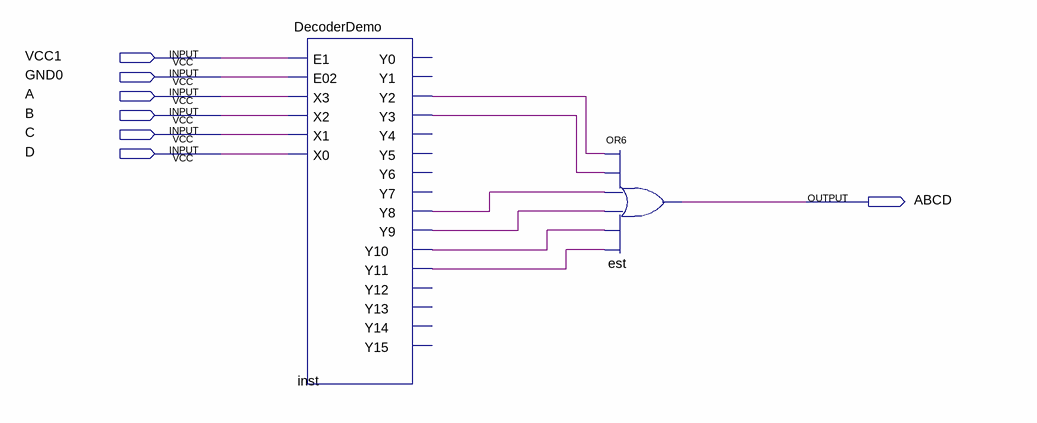
[diagram p0: schematic sheet]
// Quartus schematic DecoderDemo3.bdf as structural Verilog: 2 symbols, 7 pins
module DecoderDemo3 (
  input  VCC1,
  input  GND0,
  input  A,
  input  B,
  input  C,
  input  D,
  output ABCD
);

  wire inst_y2, inst_y3, inst_y8, inst_y9, inst_y10, inst_y11;

  DecoderDemo inst (
    .E1(VCC1), .E02(GND0), .X3(A), .X2(B), .X1(C), .X0(D), .Y2(inst_y2), .Y3(inst_y3), .Y8(inst_y8),
    .Y9(inst_y9), .Y10(inst_y10), .Y11(inst_y11));  // open: Y0, Y1, Y4, Y5, Y6, Y7, Y12, Y13, Y14, Y15
  or est (ABCD, inst_y2, inst_y3, inst_y8, inst_y9, inst_y10, inst_y11);
endmodule
